# Altium schematic sheet [1] - MCU.SchDoc
size A4
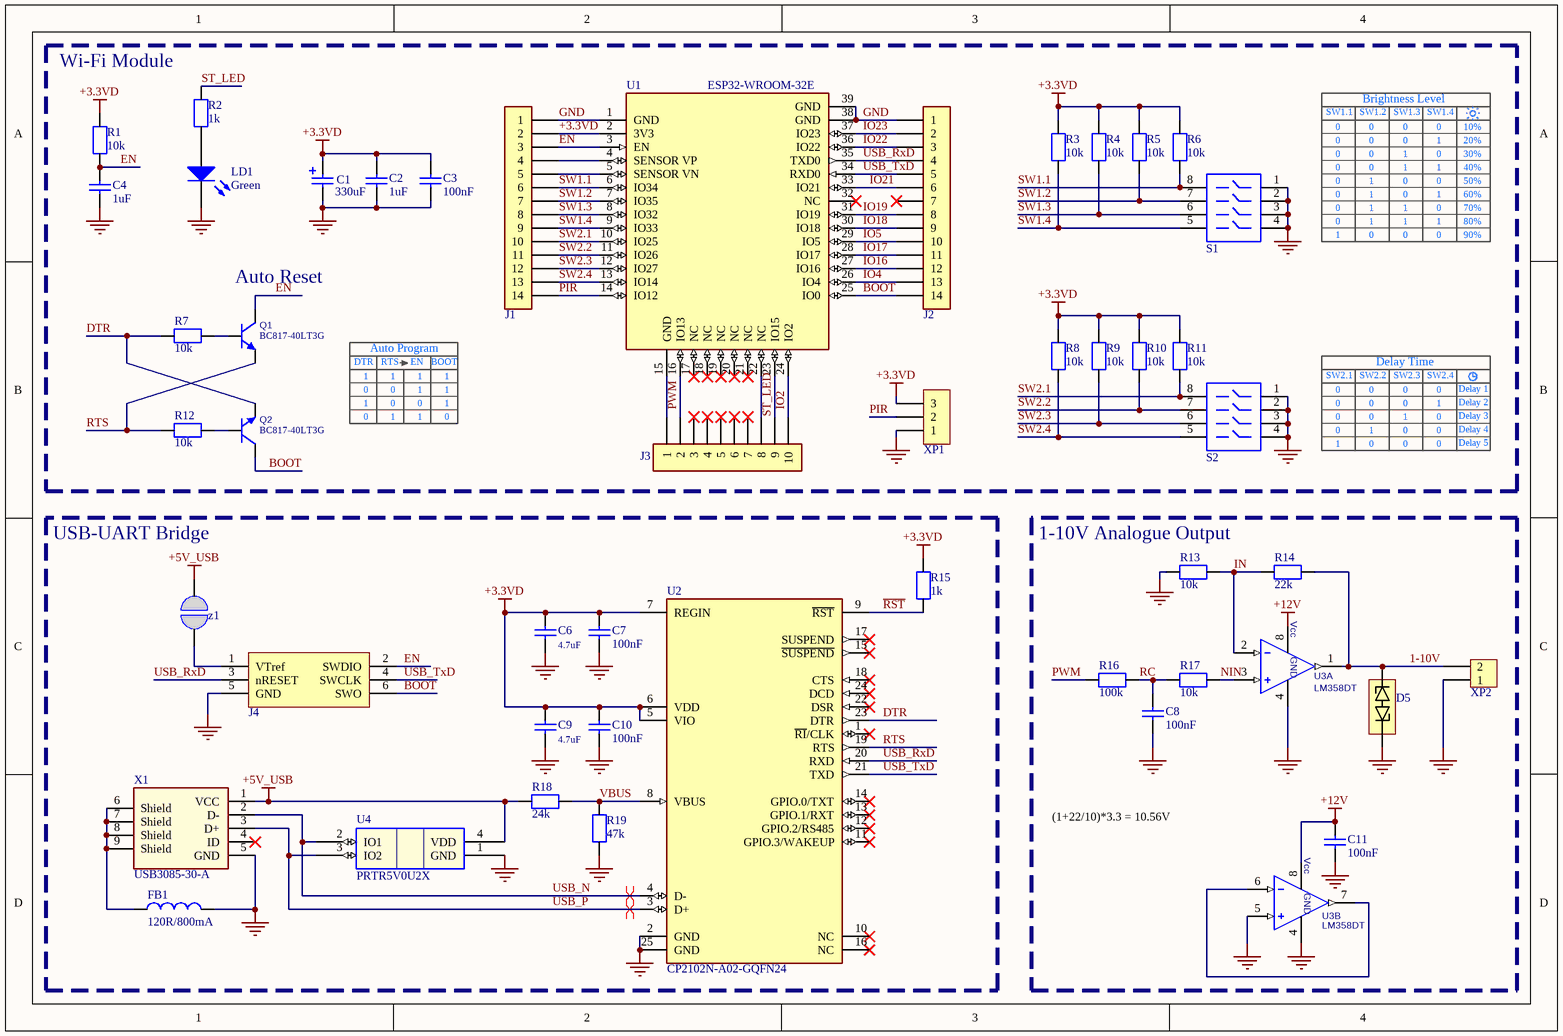
[diagram p0: [1] - MCU.SchDoc]

## Parts
C1  330uF  [TANT CAP CASE B]
C2  1uF  [CC0603]
C3  100nF  [CC0603]
C4  1uF  [CC0603]
C6  4.7uF  [CC0603]
C7  100nF  [CC0603]
C8  100nF  [CC0603]
C9  4.7uF  [CC0603]
C10  100nF  [CC0603]
C11  100nF  [CC0603]
D5  CDSOD323-T12SC  [SOD323]  (value not drawn)
FB1  120R/800mA  [ind0603]
J1  TMS-114-02-L-S  [TMS-114-YY-XX-S]  (value not drawn)
J2  TMS-114-02-L-S  [TMS-114-YY-XX-S]  (value not drawn)
J3  TMS-110-02-L-S  [SAMTEC_TMS-110-02-L-S]  (value not drawn)
J4  TC2030-IDC  [TC2030-IDC]  (value not drawn)  (no BOM)
LD1  Color: Green  [LED0603]  (hidden comment: LED)
Q1  BC817-40LT3G  [SOT23-3]
Q2  BC817-40LT3G  [SOT23-3]
R1  10k  [RC0603]
R2  1k  [RC0603]
R3  10k  [RC0603]
R4  10k  [RC0603]
R5  10k  [RC0603]
R6  10k  [RC0603]
R7  10k  [RC0603]
R8  10k  [RC0603]
R9  10k  [RC0603]
R10  10k  [RC0603]
R11  10k  [RC0603]
R12  10k  [RC0603]
R13  10k  [RC0603]
R14  22k  [RC0603]
R15  1k  [RC0603]
R16  100k  [RC0603]
R17  10k  [RC0603]
R18  24k  [RC0603]
R19  47k  [RC0603]
S1  SW-DIP4  [SW-DIP-8]  (value not drawn)
S2  SW-DIP4  [SW-DIP-8]  (value not drawn)
U1  ESP32-WROOM-32E  [ESP32-WROOM-32E-Footprint-1]
U2  CP2102N-A02-GQFN24  [FP-CP2102N-A02-GQFN24-MFG]
U3  LM358DT  [SO-8]  (parts A,B of 2)
U4  PRTR5V0U2X  [SOT190P230X110-4L]
X1  USB3085-30-A  [USB3085-30-A]
XP1  Header 3x1pins  [MC 1,5_3-G-3,81]  (value not drawn)
XP2  Header 2x1pins  [MC 1,5_2-G-3,81]  (value not drawn)
z1  SHORT  [PAD_JUMPER]  (value not drawn)  (no BOM)

## Blocks framed on the sheet
USB-UART Bridge: C6 C7 C9 C10 FB1 J4 R15 R18 R19 U2 U4 X1 z1
1-10V Analogue Output: C8 C11 D5 R13 R14 R16 R17 U3 XP2

## Nets
+3.3VD: C1.1 C2.1 C3.1 C6.1 C7.1 C9.1 C10.1 J1.2 R1.2 R3.2 R4.2 R5.2 R6.2 R8.2 R9.2 R10.2 R11.2 R15.2 U1.2(3V3) U2.5(VIO) U2.6(VDD) U2.7(REGIN) XP1.3
+5V_USB: R18.2 U4.4(VDD) X1.1(VCC) z1.1
+12V: C11.1 U3.8(Vcc)
GND: C1.2 C2.2 C3.2 C4.2 C6.2 C7.2 C8.2 C9.2 C10.2 C11.2 D5.2(P2) FB1.1 J1.1 J2.1 J4.5(GND) LD1.1(K) R13.1 R19.1 S1.1 S1.2 S1.3 S1.4 S2.1 S2.2 S2.3 S2.4 U1.1(GND) U1.38(GND) U1.39(GND) U2.2(GND) U2.25(GND) U3.4(GND) U3.5(IN2+) U4.1(GND) X1.5(GND) XP1.1 XP2.1
1-10V: D5.1(P1) R14.2 U3.1(OUT1) XP2.2
BOOT: J2.14 J4.6(SWO) Q2.3(C) U1.25(IO0)
DTR: Q2.2(E) R7.2 U2.23(DTR)
EN: C4.1 J1.3 J4.2(SWDIO) Q1.3(C) R1.1 U1.3(EN)
IN: R13.2 R14.1 U3.2(IN1-)
IO2: J3.10 U1.24(IO2)
IO4: J2.13 U1.26(IO4)
IO5: J2.10 U1.29(IO5)
IO16: J2.12 U1.27(IO16)
IO17: J2.11 U1.28(IO17)
IO18: J2.9 U1.30(IO18)
IO19: J2.8 U1.31(IO19)
IO21: J2.6 U1.33(IO21)
IO22: J2.3 U1.36(IO22)
IO23: J2.2 U1.37(IO23)
NIN: R17.1 U3.3(IN1+)
PIR: J1.14 U1.14(IO12) XP1.2
PWM: J3.2 R16.1 U1.16(IO13)
~{RST}: R15.1 U2.9(~{RST})
RC: C8.1 R16.2 R17.2
RTS: Q1.2(E) R12.2 U2.19(RTS)
ST_LED: J3.9 R2.2 U1.23(IO15)
SW1.1: J1.6 R6.1 S1.8 U1.6(IO34)
SW1.2: J1.7 R5.1 S1.7 U1.7(IO35)
SW1.3: J1.8 R4.1 S1.6 U1.8(IO32)
SW1.4: J1.9 R3.1 S1.5 U1.9(IO33)
SW2.1: J1.10 R11.1 S2.8 U1.10(IO25)
SW2.2: J1.11 R10.1 S2.7 U1.11(IO26)
SW2.3: J1.12 R9.1 S2.6 U1.12(IO27)
SW2.4: J1.13 R8.1 S2.5 U1.13(IO14)
USB_N: U2.4(D-) U4.2(IO1) X1.2(D-)
USB_P: U2.3(D+) U4.3(IO2) X1.3(D+)
USB_RxD: J2.4 J4.3(nRESET) U1.35(TXD0) U2.20(RXD)
USB_TxD: J2.5 J4.4(SWCLK) U1.34(RXD0) U2.21(TXD)
VBUS: R18.1 R19.2 U2.8(VBUS)
NetFB1_2: FB1.2 X1.6(Shield) X1.7(Shield) X1.8(Shield) X1.9(Shield)
NetJ1_4: J1.4 U1.4(SENSOR_VP)
NetJ1_5: J1.5 U1.5(SENSOR_VN)
NetJ3_1: J3.1 U1.15(GND)
NetJ3_8: J3.8 U1.22(NC)
NetJ4_1: J4.1(VTref) z1.2
NetLD1_2: LD1.2(A) R2.1
NetQ1_1: Q1.1(B) R7.1
NetQ2_1: Q2.1(B) R12.1
NetU3_6: U3.6(IN2-) U3.7(OUT2)

Not connected (* = marked no-connect by the designer): J2 7*; J3 3* 4* 5* 6* 7*; U1 17(NC)* 18(NC)* 19(NC)* 20(NC)* 21(NC)* 32(NC)*; U2 1(~{RI}/CLK)* 10(NC)* 11(GPIO.3/WAKEUP)* 12(GPIO.2/RS485)* 13(GPIO.1/RXT)* 14(GPIO.0/TXT)* 15(~{SUSPEND})* 16(NC)* 17(SUSPEND)* 18(CTS)* 22(DSR)* 24(DCD)*; X1 4(ID)*

## Layout directives
differential pair; ClassDiffPair: DIFF90: USB_N, USB_P

## Notes on the sheet
- Wi-Fi Module
- SW1.1
- SW1.2
- Brightness Level
- SW1.3
- SW1.4
- 0
- 1
- 10%
- 20%
- 30%
- 40%
- 50%
- 60%
- 70%
- 80%
- 90%
- Auto Reset
- DTR
- Auto Program
- RTS
- EN
- BOOT
- SW2.1
- SW2.2
- Delay Time
- SW2.3
- SW2.4
- Delay 1
- Delay 2
- Delay 3
- Delay 4
- Delay 5
- (1+22/10)*3.3 = 10.56V

## Library data of the parts
C1 = Capacitors_SMD_TANT: Surface Mount Tantalum Capacitor, 330 µF, 6.3 V, 1411 [3528 Metric], ± 20%, 0.8 ohm, B; Manufacturer: KEMET; Manufacturer Part Number: T490B337M006ATE800; PatternType: Case B; Leakage Current: 10uA; ESR ESL: 800mOhm; TCC: +/-30ppm; Tolerance: +/-20%; Working Voltage: 6.3V; Material: robust MnO2; Operating Temperature Range: -55 to +125C; Mouser Link: https://eu.mouser.com/ProductDetail/KEMET/T490B337M006ATE800?qs=sGAEpiMZZMuEN2agSAc2pgET7l35QYXOsH8qSVOu0i72mFceis6X4Q%3d%3d; Digikey Link: https://www.digikey.com/products/en?keywords=490B337M006ATE800; Farnell Link: https://uk.farnell.com/search?st=T490B337M006ATE800; Value: 330uF
C2 C4 = Capacitors_SMD: SMD Multilayer Ceramic Capacitor, 1 µF, 16 V, 0603 [1608 Metric], ± 10%, X7R, MC; Manufacturer: MULTICOMP; Manufacturer Part Number: MC0603B105K160CT; TCC: +/-30ppm; Tolerance: +/-10%; Working Voltage: 16V; ESR ESL: 0.1Ohm/100MHz; Leakage Current: 10uA; PatternType: 0603; Value: 1uF; Material: Ceramic; Dielectric: X7R; Operating Temperature Range: -55C to 125C; Mouser Link: *; Farnell Link: https://uk.farnell.com/w/c/passive-components/capacitors/ceramic-capacitors/smd-ceramic-multilayer-mlcc-capacitors?brand=pro-power|stellar-labs|pro-elec|defender-security|duratool|tenma|mcm-custom-audio|pro-signal|mcm|multicomp&ceramic-capacitor-case=0603-1608-metric-&capacitance=1uf; Digikey Link: *
C3 C7 C8 C10 C11 = Capacitors_SMD: SMD Multilayer Ceramic Capacitor, 0.1 µF, 16 V, 0603 [1608 Metric], ± 10%, X7R, MC; Manufacturer: MULTICOMP; Manufacturer Part Number: MC0603B104K160CT; TCC: +/-30ppm; Tolerance: +/-10%; Working Voltage: 16V; ESR ESL: 0.1Ohm/100MHz; Leakage Current: 10uA; PatternType: 0603; Value: 100nF; Material: Ceramic; Dielectric: X7R; Operating Temperature Range: -55C to 125C; Mouser Link: https://eu.mouser.com/ProductDetail/AVX/06033C104KAT2A?qs=sGAEpiMZZMs0AnBnWHyRQNmRHsAguE21wvjfH6R99Ys%3d; Farnell Link: https://uk.farnell.com/w/search/prl/results?st=MC0603B104K160CT&scope=partnumberlookahead&searchref=searchlookahead; Digikey Link: https://www.digikey.com/product-detail/en/avx-corporation/06033C104KAT2A/478-3714-1-ND/1116412
C6 C9 = Capacitors_SMD_10: SMD Multilayer Ceramic Capacitor, 4.7 µF, 6.3 V, 0603 [1608 Metric], ± 10%, X7R, CL; Manufacturer: SAMSUNG ELECTRO-MECHANICS; Manufacturer Part Number: CL10B475KQ8NQNC; TCC: +/-30ppm; Tolerance: +/-10%; Working Voltage: 6.3V; ESR ESL: 0.1Ohm/100MHz; Leakage Current: 10uA; PatternType: 0805; Value: 4.7uF; Material: Ceramic; Dielectric: X7R; Operating Temperature Range: -55C to 125C
D5 = CDSOD323-T12SC: TVS DIODE 12VWM 29.5VC SOD323; Manufacturer: Bourns; Current: 14A; Voltage: 12V; Pb Free: Yes; Part Number: CDSOD323-T12SC; Temperature: -55 - +150 C; Manufacturer Part Number: CDSOD323-T12SC; Component Type: Standard; Case: SOD323; ComponentLink2Description: Datasheet; ComponentLink2URL: http://www.bourns.com/docs/Product-Datasheets/CDSOD323-TxxSC.pdf; Published: 01.03.2018; Publisher: dlehkobyt; STATUS: CHECKED
FB1 = Inductor_SMD: Ferrite Bead, 0603 [1608 Metric], 120 ohm, 800 mA, BLM18AG, 0.18 ohm, ± 25%; Manufacturer: Murata Electronics; Manufacturer Part Number: BLM18AG121BH1D; Tolerance: +/-25%; PatternType: 0603; Maximum DC Current: 800mA; Maximum DC Resistance: 180mR; Material: Ferrite Beads; Mouser Link: https://eu.mouser.com/ProductDetail/Murata-Electronics/BLM18AG121BH1D?qs=sGAEpiMZZMt1hubY80%2fs8LxeSWHv6KC8Ysx%252bo%2fdcLHuRxr%252bGZcH%2ffA%3d%3d; Digikey Link: https://www.digikey.com/product-detail/en/murata-electronics-north-america/BLM18AG121BH1D/490-14034-1-ND/6156034; Farnell Link: *; Value: 120R/800mA; Operating Temperature Range: -55C to +125C; Qmin: *
J1 J2 = TMS-114-02-L-S: Pin Header, Vertical, Board-to-Board, 1.27 mm, 1 Rows, 14 Contacts, Through Hole, TMS; Manufacturer: SAMTEC; Datasheet Link: http://suddendocs.samtec.com/prints/tms-1xx-xx-xx-x-xx-xxx-mkt.pdf; Manufacturer Part Number: TMS-114-02-L-S; Mouser Part Number: 200-TMS11402LS; Mouser Price/Stock: https://www.mouser.co.uk/ProductDetail/Samtec/TMS-114-02-L-S?qs=%252BZP6%2F%252BtExtAXvdN94tPASA%3D%3D
J3 = TMS-110-02-L-S: Pin Header, Vertical, Board-to-Board, 1.27 mm, 1 Rows, 10 Contacts, Through Hole, TMS; Manufacturer: SAMTEC; Datasheet Link: http://suddendocs.samtec.com/prints/tms-1xx-xx-xx-x-xx-xxx-mkt.pdf; Manufacturer Part Number: TMS-110-02-L-S
J4 = TC2030-IDC: TC2030-IDC 6-Pin Tag-Connect Plug-of-Nails™ Spring-Pin Cable with Legs
LD1 = TLMG1100-GS08: LED GREEN 0603 SMD; Manufacturer: Vishay Semiconductors; Current: 20mA; Voltage: 2.1V; Part Number: TLMG1100-GS08; Temperature: -40 - +100 C; Manufacturer Part Number: TLMG1100-GS08; Component Type: Standard; Case: LED0603; ComponentLink2Description: Datasheet; ComponentLink2URL: http://www.vishay.com/docs/83173/tlmb1100.pdf; Published: 10.12.2014; Publisher: asavchenko; STATUS: CHECKED
Q1 Q2 = BC817-40LT1G: TRANS NPN 45V 0.5A SOT23; Manufacturer: ONS, NXP; Pb Free: Yes; Part Number: BC817-40LT3G; Current: 0.5A; Voltage CEO: 45V; Temperature: -55 - +150 C; Manufacturer Part Number: BC817-40LT3G; Component Type: Standard; Case: SOT23-3; ComponentLink2Description: Datasheet; ComponentLink2URL: http://www.onsemi.com/pub/Collateral/BC817-16LT1-D.PDF
R1 R3-R13 R17 = Resistors_SMD: SMD Chip Resistor, 10 kohm, ± 1%, 100 mW, 0603 [1608 Metric], Thick Film, General Purpose; Manufacturer: MULTICOMP; Manufacturer Part Number: MCWR06X1002FTL; TCR: +/-100ppm/C; Tolerance: +/-1%; Working Voltage: 0402, 0603 =75V, 0805 =100V, 1206 =200V; Power Rating: 0402 =50, 0603 =150, 0805 =200, 1206 =400mW; PatternType: 0603; Value: 10k; Operating Temperature Range: -55C to 250C; Material: Titalum nitride; Mouser Link: *; Digikey Link: *; Farnell Link: https://uk.farnell.com/multicomp/mcwr06x1001ftl/res-1k-1-0-1w-0603-thick-film/dp/2447272
R2 R15 = Resistors_SMD: SMD Chip Resistor, 1 kohm, ± 1%, 100 mW, 0603 [1608 Metric], Thick Film, General Purpose; Manufacturer: MULTICOMP; Manufacturer Part Number: MCWR06X1001FTL; TCR: +/-100ppm/C; Tolerance: +/-1%; Working Voltage: 0402, 0603 =75V, 0805 =100V, 1206 =200V; Power Rating: 0402 =50, 0603 =150, 0805 =200, 1206 =400mW; PatternType: 0603; Value: 1k; Operating Temperature Range: -55C to 250C; Material: Titalum nitride; Mouser Link: *; Digikey Link: *; Farnell Link: https://uk.farnell.com/multicomp/mcwr06x1001ftl/res-1k-1-0-1w-0603-thick-film/dp/2447272
R14 = Resistors_SMD: SMD Chip Resistor, 22 kohm, ± 1%, 100 mW, 0603 [1608 Metric], Thick Film, General Purpose; Manufacturer: MULTICOMP; Manufacturer Part Number: MCWR06X2202FTL; TCR: +/-100ppm/C; Tolerance: +/-1%; Working Voltage: 0402, 0603 =75V, 0805 =100V, 1206 =200V; Power Rating: 0402 =50, 0603 =150, 0805 =200, 1206 =400mW; PatternType: 0603; Value: 22k; Operating Temperature Range: -55C to 250C; Material: Titalum nitride; Mouser Link: *; Digikey Link: *
R16 = Resistors_SMD_4: SMD Chip Resistor, 100 kohm, ± 1%, 100 mW, 0603 [1608 Metric], Thick Film, General Purpose; Manufacturer: MULTICOMP; Manufacturer Part Number: MCWR06X1003FTL; TCR: +/-100ppm/C; Tolerance: +/-1%; Working Voltage: 0402, 0603 =75V, 0805 =100V, 1206 =200V; Power Rating: 0402 =50, 0603 =150, 0805 =200, 1206 =400mW; PatternType: 0603; Value: 100k; Operating Temperature Range: -55C to 250C; Material: Titalum nitride; Mouser Link: *; Digikey Link: *; Farnell Link: https://uk.farnell.com/w/search/prl/results?st=MCWR06X1003FTL&scope=partnumberlookahead&searchref=searchlookahead
R18 = Resistors_SMD_24: SMD Chip Resistor, 24 kohm, ± 1%, 100 mW, 0603 [1608 Metric], Thick Film, General Purpose; Manufacturer: MULTICOMP; Manufacturer Part Number: MCWR06X2402FTL; TCR: +/-100ppm/C; Tolerance: +/-1%; Working Voltage: 0402, 0603 =75V, 0805 =100V, 1206 =200V; Power Rating: 0402 =50, 0603 =150, 0805 =200, 1206 =400mW; PatternType: 0603; Value: 24k; Operating Temperature Range: -55C to 250C; Material: Titalum nitride; Mouser Link: *; Digikey Link: *
R19 = Resistors_SMD_24: SMD Chip Resistor, 47 kohm, ± 1%, 100 mW, 0603 [1608 Metric], Thick Film, General Purpose; Manufacturer: MULTICOMP; Manufacturer Part Number: MCWR06X4702FTL; TCR: +/-100ppm/C; Tolerance: +/-1%; Working Voltage: 0402, 0603 =75V, 0805 =100V, 1206 =200V; Power Rating: 0402 =50, 0603 =150, 0805 =200, 1206 =400mW; PatternType: 0603; Value: 47k; Operating Temperature Range: -55C to 250C; Material: Titalum nitride; Mouser Link: *; Digikey Link: *; Farnell Link: https://www.newark.com/multicomp-pro/mcwr06x4702ftl/res-47k-1-100mw-0603-thick-film/dp/94X1641
S1 S2 = SW-DIP4: DIP / SIP Switch, 4 Circuits, Raised Slide, Through Hole, SPST-NO, 24 V, 25 mA; Part Number: MCNDS-04V; Manufacturer: MULTICOMP PRO; Permitted current: 0.05A; Pins number: 16; Temperature: -55..+85 C; Manufacturer Part Number: MCNDS-04V; Component Type: Dip switch; Case: SW-DIP-16; ComponentLink2Description: Datasheet; ComponentLink2URL: http://www.ctscorp.com/components/Datasheets/206-208.pdf
U1 = ESP32-WROOM-32E: Manufacturer: Espressif Systems; Manufacturer Part Number: ESP32-WROOM-32E-N16
U2 = CMP-08107-000010-1: IC USB TO UART BRIDGE QFN24; Manufacturer: Silabs; Manufacturer Part Number: CP2102N-A02-GQFN24
U3 = LM358DT: Operational Amplifier, Dual, 2 Amplifier, 1.1 MHz, 0.6 V/µs, 3V to 30V, SOIC, 8 Pins; Manufacturer: STMICROELECTRONICS; Pb Free: Yes; Part Number: LM358DT; Temperature: 0 - + 70 C; Manufacturer Part Number: LM358DT; Component Type: Standard; Case: SO-8; ComponentLink2Description: Datasheet; ComponentLink2URL: https://www.farnell.com/datasheets/2000357.pdf
U4 = PRTR5V0U2X_Protect: ESD Protection Device, TVS, 7.5 V, SOT-143B, 4 Pins, 5.5 V, PRTR5; Manufacturer: NXP Semiconductor; Value: ESD Protection 8kV; Working Voltage: 5V; PatternType: SOT143B; ESD Protection: up to 8kV; Vbr Breakdown Voltage: 6Vmin to 9Vmax; Operating Temperature Range: -40C to 80C; Farnell Link: http://uk.farnell.com/nexperia/prtr5v0u2x/diode-tvs-dual-sot-143b/dp/1524157?st=PRTR5V0U2X; Manufacturer Part Number: PRTR5V0U2X; Mouser Link: https://eu.mouser.com/ProductDetail/Nexperia/PRTR5V0U2X215?qs=sGAEpiMZZMvKM5ialpXrmha212gV%252bN%252bb; Digikey Link: https://www.digikey.com/product-detail/en/nexperia-usa-inc/PRTR5V0U2X215/1727-3884-1-ND/1589981
X1 = USB3085-30-A: USB Connector, Micro USB Type AB, USB 2.0, Receptacle, 5 Ways, Surface Mount, Right Angle; Manufacturer: GTC; Working Voltage: 30VAC/DC; Value: USB2.0 / Micro USB Type AB; PatternType: USB3085-30-A; Manufacturer Part Number: USB3085-30-A; Operating Temperature Range: -30 to 85 ℃; Digikey Link: *; Farnell Link: https://uk.farnell.com/search?st=USB3085; Mouser Link: *
XP1 = MC 1,5/ 3-G-3,81: Terminal Block, Header, 3.81 mm, 3 Ways, 8 A, 160 V, Through Hole Right Angle; Manufacturer: PHOENIX CONTACT; Permitted current: 8A; Pins number: 3; Pb Free: Yes; Part Number: MC 1,5/ 3-G-3,81; Temperature: -40 - +105 C; Manufacturer Part Number: MC 1,5/ 3-G-3,81; Component Type: Standard; Case: MC 1,5_3-G-3,81; ComponentLink2Description: Datasheet; Published: 14.11.2013; Publisher: dlegkobyt; STATUS: CHECKED
XP2 = MC 1,5/ 2-G-3,81: Terminal Block, Header, 3.81 mm, 2 Ways, 8 A, 160 V, Through Hole Right Angle; Manufacturer: PHOENIX CONTACT; Permitted current: 8A; Pins number: 2; Pb Free: Yes; Part Number: MC 1,5/ 2-G-3,81; Temperature: -40 - +105 C; Manufacturer Part Number: MC 1,5/ 2-G-3,81; Component Type: Standard; Case: MC 1,5_2-G-3,81; ComponentLink2Description: Datasheet; Published: 14.11.2013; Publisher: dlegkobyt; STATUS: CHECKED
z1 = JUMPER_OPEN